# Altium schematic sheet Keypad Controller.SchDoc
size A4
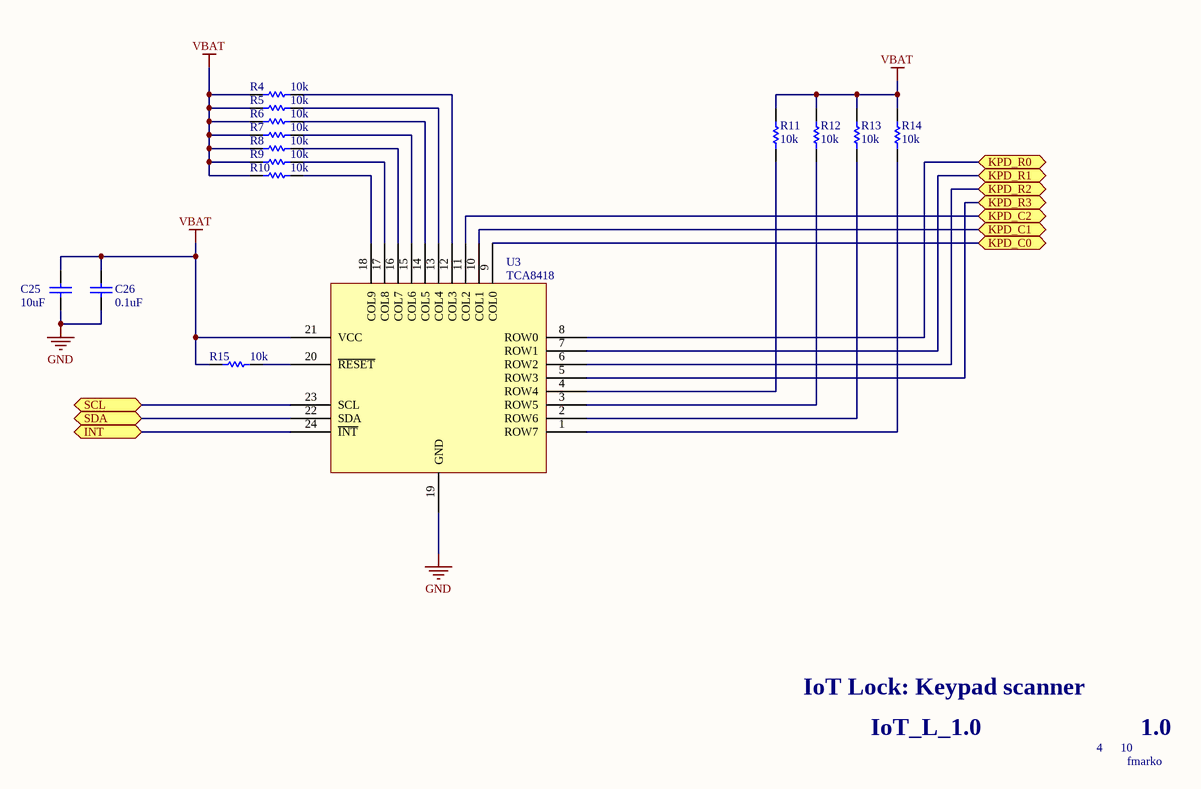
[diagram p0: Keypad Controller.SchDoc]

## Parts
C25  value 10uF  [1608[0603]]  (hidden comment: GRM1555C1HR50BA01D)
C26  value 0.1uF  [0402]  (hidden comment: GRM1555C1HR50BA01D)
R4  value 10k  [0402]  (hidden comment: Res Semi)
R5  value 10k  [0402]  (hidden comment: Res Semi)
R6  value 10k  [0402]  (hidden comment: Res Semi)
R7  value 10k  [0402]  (hidden comment: Res Semi)
R8  value 10k  [0402]  (hidden comment: Res Semi)
R9  value 10k  [0402]  (hidden comment: Res Semi)
R10  value 10k  [0402]  (hidden comment: Res Semi)
R11  value 10k  [0402]  (hidden comment: Res Semi)
R12  value 10k  [0402]  (hidden comment: Res Semi)
R13  value 10k  [0402]  (hidden comment: Res Semi)
R14  value 10k  [0402]  (hidden comment: Res Semi)
R15  value 10k  [0402]  (hidden comment: Res Semi)
U3  TCA8418  [PQFN50P400X400X80_HS-25N]

## Ports
INT, KPD_C0, KPD_C1, KPD_C2, KPD_R0, KPD_R1, KPD_R2, KPD_R3, SCL, SDA

## Nets
GND: C25.1 C26.1 U3.19(GND)
VBAT: C25.2 C26.2 R4.1 R5.1 R6.1 R7.1 R8.1 R9.1 R10.1 R11.2 R12.2 R13.2 R14.2 R15.1 U3.21(VCC)
INT: U3.24(~{INT}) ; port INT
KPD_C0: U3.9(COL0) ; port KPD_C0
KPD_C1: U3.10(COL1) ; port KPD_C1
KPD_C2: U3.11(COL2) ; port KPD_C2
KPD_R0: U3.8(ROW0) ; port KPD_R0
KPD_R1: U3.7(ROW1) ; port KPD_R1
KPD_R2: U3.6(ROW2) ; port KPD_R2
KPD_R3: U3.5(ROW3) ; port KPD_R3
SCL: U3.23(SCL) ; port SCL
SDA: U3.22(SDA) ; port SDA
NetR4_2: R4.2 U3.12(COL3)
NetR5_2: R5.2 U3.13(COL4)
NetR6_2: R6.2 U3.14(COL5)
NetR7_2: R7.2 U3.15(COL6)
NetR8_2: R8.2 U3.16(COL7)
NetR9_2: R9.2 U3.17(COL8)
NetR10_2: R10.2 U3.18(COL9)
NetR11_1: R11.1 U3.4(ROW4)
NetR12_1: R12.1 U3.3(ROW5)
NetR13_1: R13.1 U3.2(ROW6)
NetR14_1: R14.1 U3.1(ROW7)
NetR15_2: R15.2 U3.20(~{RESET})

## Notes on the sheet
- IoT Lock: Keypad scanner
- IoT_L_1.0
- 4
- 10
- 1.0
- fmarko

## Library data of the parts
C25 C26 = Cap: Capacitor; Published: 8-Jun-2000; LatestRevisionDate: 17-Jul-2002; LatestRevisionNote: Re-released for DXP Platform.; PackageReference: RAD-0.3; Publisher: Altium Limited; PackageDescription: Radial Cap, Thru-Hole; 2 Leads; 0.3 in Pin Spacing
R4-R15 = Res Semi: Semiconductor Resistor; Published: 8-Jun-2000; LatestRevisionDate: 17-Jul-2002; LatestRevisionNote: Re-released for DXP Platform.; PackageReference: AXIAL-0.5; Publisher: Altium Limited; PackageDescription: Axial Device, Thru-Hole; 2 Leads; 0.5 in Pin Spacing
U3 = TCA8418: I2C keyboard controller, TI